# Altium schematic sheet Power.SchDoc
size B; SheetNumber: 6; SheetTotal: 6
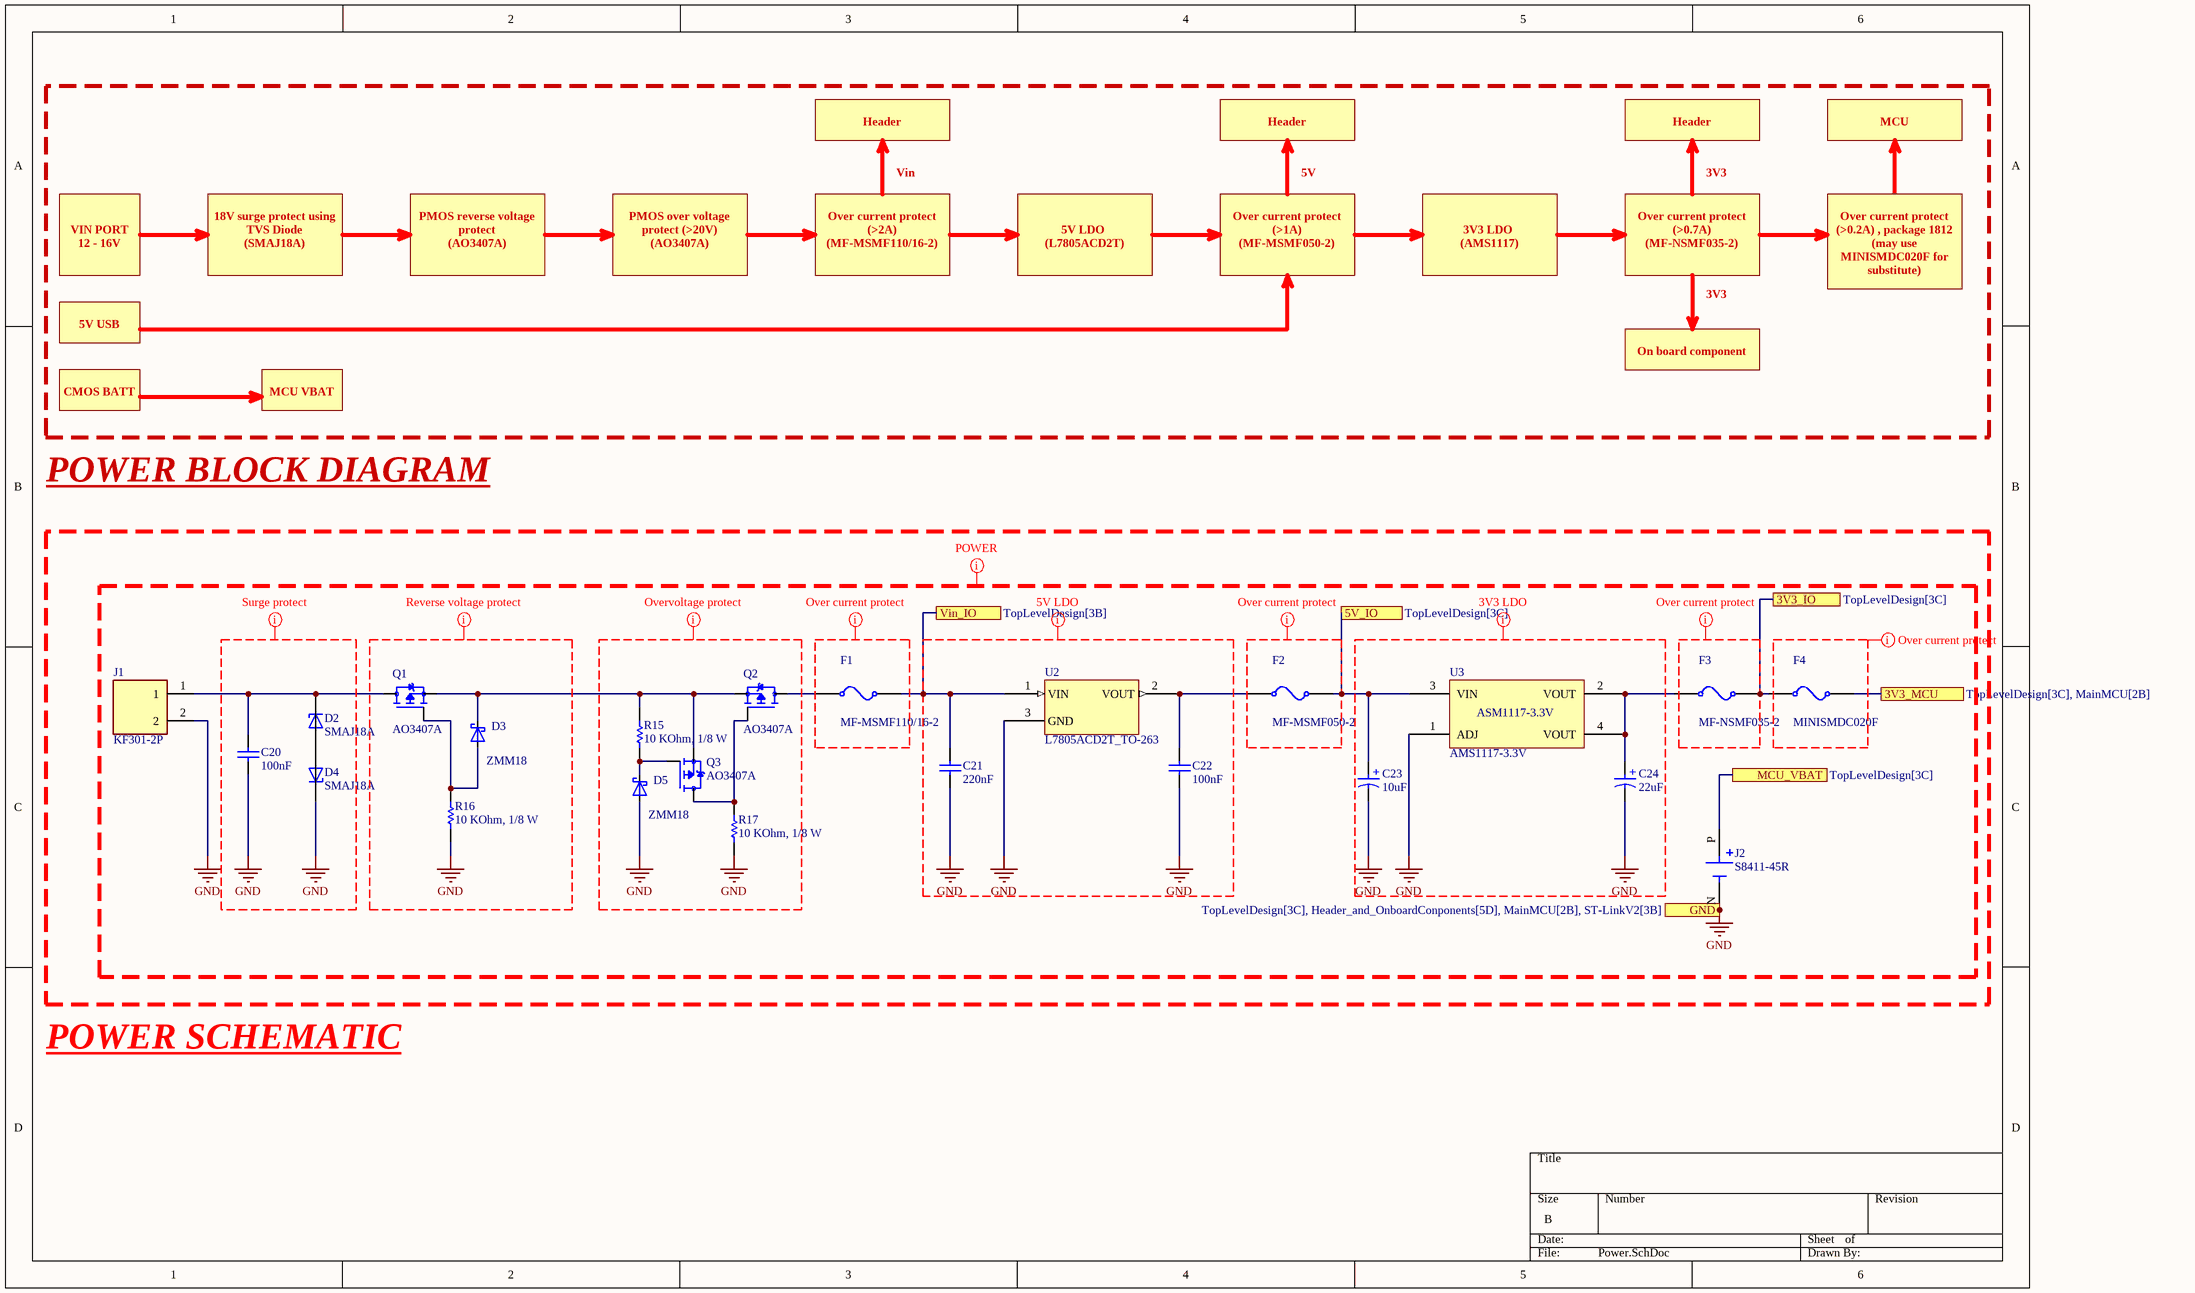
[diagram p0: Power.SchDoc]

## Parts
C20  value 100nF  [CAP_0805]  (hidden comment: 0108051041050)
C21  value 220nF  [CAP_0603]  (hidden comment: 0106032241050)
C22  value 100nF  [CAP_0603]  (hidden comment: 0106031041050)
C23  10uF  [WCAP-ASLI_D4H5.5]
C24  22uF  [WCAP-ASLI_D6.3H7.7]
D2  SMAJ18A  [DIOM4325X250N]
D3  ZMM18  [SOD-80_MiniMELF_Glass]
D4  SMAJ18A  [DIOM4325X250N]
D5  ZMM18  [SOD-80_MiniMELF_Glass]
F1  MF-MSMF110/16-2  [Fuse_SMD_1812]
F2  MF-MSMF050-2  [Fuse_SMD_1812]
F3  MF-NSMF035-2  [Fuse_SMD_1206]
F4  MINISMDC020F  [Fuse_SMD_1812]
J1  KF301-2P  [HANDSON_KF301-2P]
J2  S8411-45R  [HARWIN_S8411-45R]
Q1  AO3407A  [SOT95P280X125-3N]
Q2  AO3407A  [SOT95P280X125-3N]
Q3  AO3407A  [SOT95P280X125-3N]
R15  value 10 KOhm, 1/8 W  [RESISTOR_0805]  (hidden comment: 0008051031)
R16  value 10 KOhm, 1/8 W  [RESISTOR_0805]  (hidden comment: 0008051031)
R17  value 10 KOhm, 1/8 W  [RESISTOR_0805]  (hidden comment: 0008051031)
U2  L7805ACD2T_TO-263  [TO-263]
U3  AMS1117-3.3V  [AMS1117-3.3V SOT223]

## Ports
3V3_IO (see TopLevelDesign[3C]), 3V3_MCU (see TopLevelDesign[3C], MainMCU[2B]), 5V_IO (see TopLevelDesign[3C]), GND (see TopLevelDesign[3C], Header_and_OnboardConponents[5D], MainMCU[2B], ST-LinkV2[3B]), MCU_VBAT (see TopLevelDesign[3C]), Vin_IO (see TopLevelDesign[3B])

## Nets
GND: C20.1 C21.1 C22.1 C23.2(N) C24.2(N) D4.C D5.A J1.2 J2.N(NEG) R16.1 R17.1 U2.3(GND) U3.1(ADJ) ; port GND
3V3_IO: F3.1 F4.0 ; port 3V3_IO
3V3_MCU: F4.1 ; port 3V3_MCU
5V_IO: C23.1(P) F2.1 U3.3(VIN) ; port 5V_IO
MCU_VBAT: J2.P(POS) ; port MCU_VBAT
Vin_IO: C21.2 F1.1 U2.1(VIN) ; port Vin_IO
NetC20_2: C20.2 D2.C J1.1 Q1.3(D)
NetC22_2: C22.2 F2.0 U2.2(VOUT)
NetC24_1: C24.1(P) F3.0 U3.2(VOUT) U3.4(VOUT)
NetD2_A: D2.A D4.A
NetD3_A: D3.A Q1.1(G) R16.2
NetD3_K: D3.K Q1.2(S) Q2.2(S) Q3.2(S) R15.2
NetD5_K: D5.K Q3.1(G) R15.1
NetF1_0: F1.0 Q2.3(D)
NetQ2_1: Q2.1(G) Q3.3(D) R17.2

## Layout directives
net class POWER: GND
rule Width Constraint [Pref Width = 35mil    Min Width = 30mil    Max Width = 500mil]: GND
rule Width Constraint [Pref Width = 35mil    Min Width = 30mil    Max Width = 200mil]: (no net found under the mark), GND
rule Width Constraint [Pref Width = 20mil    Min Width = 20mil    Max Width = 200mil]: (no net found under the mark)
rule Width Constraint [Pref Width = 15mil    Min Width = 10mil    Max Width = 100mil]: (no net found under the mark)
rule Width Constraint [Pref Width = 10mil    Min Width = 10mil    Max Width = 100mil]: (no net found under the mark)
rule Width Constraint [Pref Width = 30mil    Min Width = 20mil    Max Width = 200mil]: GND
rule Width Constraint [Pref Width = 15mil    Min Width = 15mil    Max Width = 100mil]: GND

## Notes on the sheet
- Header
- MCU
- Vin
- 5V
- 3V3
- VIN PORT
  12 - 16V
- 18V surge protect using TVS Diode
  (SMAJ18A)
- PMOS reverse voltage protect
  (AO3407A)
- PMOS over voltage protect (>20V)
  (AO3407A)
- Over current protect (>2A)
  (MF-MSMF110/16-2)
- 5V LDO
  (L7805ACD2T)
- Over current protect (>1A)
  (MF-MSMF050-2)
- 3V3 LDO
  (AMS1117)
- Over current protect (>0.7A)
  (MF-NSMF035-2)
- Over current protect (>0.2A) , package 1812
  (may use MINISMDC020F for substitute)
- 5V USB
- On board component
- CMOS BATT
- MCU VBAT
- POWER BLOCK DIAGRAM
- POWER SCHEMATIC
- (in symbol CMP-014-00039-1) +
- (in symbol CMP-014-00073-1) +
- (in symbol CMP-098-000004-1) ASM1117-3.3V

## Library data of the parts
C20 = CMP-001-00259-1: CAP, size 0805, 0.1 nF, 50 VDC; Manufacture Name: TDK; Manufacture SN: CGA4J2X8R1H104K125AD; Voltage Rating DC: 50 VDC; Tolerance: 10%; Pins: 2; Supplier 2 URL: https://www.digikey.com/en/products/detail/tdk-corporation/cga4j2x8r1h104k125ad/3248169; Supplier 1 SN: 810-C2012X8R1H104KEP; Supplier 1 Name: Mouser; Supplier 3 Name: thegioiic; Mounting Technology: SMT; Source: Capacitor_0805_10_percent.SchLib; Supplier 2 SN: 445-8810-2-ND; Supplier 3 SN: OEM; Operating Temperature: -55 to +125degC; Supplier 2 Name: Digi-Key; Component Type: Standard; Design Item ID: 0108051041050; Supplier 1 URL: https://www.mouser.vn/ProductDetail/TDK/CGA4J2X8R1H104K125AD?qs=LcTL%2F5vFEzExqZqv3rh1qQ%3D%3D&utm_source=mouser-refine-download&utm_medium=file&utm_campaign=CGA4J2X8R1H104K125AD&utm_content=TDK; Supplier 3 URL: N/A; Packaging: Tape and Reel; Size: 0805
C21 = CMP-001-00231-1: CAP, size 0603, 220 nF, 50 VDC; Manufacture Name: TDK; Manufacture SN: CGA3E3X7R1H224K080AE; Tolerance: 10%; Voltage Rating DC: 50 VDC; Supplier 2 SN: 445-173635-2-ND; Supplier 3 SN: N/A; Supplier 2 URL: https://www.digikey.com/en/products/detail/tdk-corporation/cga3e3x7r1h224k080ae/5809200; Supplier 3 Name: thegioiic; Supplier 3 URL: N/A; Component Type: Standard; Supplier 2 Name: Digi-Key; Supplier 1 Name: Mouser; Size: 0603; Design Item ID: 0106032241050; Supplier 1 SN: 810-CGA3E3X7R1H224KA; Source: Capacitor_0603_10_percent.SchLib; Pins: 2; Supplier 1 URL: https://www.mouser.com/ProductDetail/TDK/CGA3E3X7R1H224K080AE?qs=nQSIdc08i%252Bd73MzLq310Yg%3D%3D&utm_source=mouser-refine-download&utm_medium=file&utm_campaign=CGA3E3X7R1H224K080AE&utm_content=TDK; Mounting Technology: SMT; Operating Temperature: -55 to +125degC; Packaging: Tape and Reel
C22 = CMP-001-00214-1: CAP, size 0603, 100 nF, 50 VDC; Manufacture SN: CGA3E3X8R1H104K080AE; Manufacture Name: TDK; Tolerance: 10%; Voltage Rating DC: 50 VDC; Supplier 2 Name: Digi-Key; Pins: 2; Supplier 3 Name: thegioiic; Design Item ID: 0106031041050; Supplier 1 Name: Mouser; Supplier 1 URL: https://www.mouser.com/ProductDetail/TDK/CGA3E3X8R1H104K080AE?qs=nQSIdc08i%252Bd8g3IRRgU2bw%3D%3D&utm_source=mouser-refine-download&utm_medium=file&utm_campaign=CGA3E3X8R1H104K080AE&utm_content=TDK; Size: 0603; Supplier 2 URL: https://www.digikey.com/en/products/detail/tdk-corporation/cga3e3x8r1h104k080ae/5809262; Operating Temperature: -55 to +125degC; Packaging: Tape and Reel; Source: Capacitor_0603_10_percent.SchLib; Supplier 1 SN: 810-CGA3E3X8R1H104KA; Supplier 3 SN: N/A; Supplier 2 SN: 445-173697-2-ND; Mounting Technology: SMT; Supplier 3 URL: N/A; Component Type: Standard
C23 = CMP-014-00039-1: V-Chip, D4 x H5.5mm, 10uF, 16V; Manufacturer: Wurth Elektronik; Endurance: 2000h; Dissipation Factor: 16%; Capacitance: 10µF; Ripple Current: 80mA; Capacitance Tolerance: +/-20%; Leakage Current: 3uA; Supplier 2 URL: N/A; Supplier 1 URL: https://www.mouser.com/ProductDetail/Wurth-Elektronik/865080340001?qs=0KOYDY2FL2%252BaqRFD837lAw%3D%3D; Manufacturer Part Number: N/A; Value: 10uF, 16V; Supplier 3 Name: thegioiic; Operating Temperature Min: -55°C; Height: 5.5mm; Category: Aluminum Electrolytic Capacitors; Diameter: 4mm; Packaging: Tape and Reel; Component Type: Standard; Supplier 3 URL: https://www.thegioiic.com/tu-nhom-smd-10uf-16v-4x5-4mm; Design Item ID: 865080340001; Supplier 1 SN: 710-865080340001; Pins: 2; Supplier 2 Name: Digi-Key; Supplier 1 Name: Mouser; Mount: Surface Mount; Supplier 3 SN: N/A; Operating Temperature Max: 105°C; Supplier 2 SN: N/A; Rated Voltage (DC): 16V; Source: Al_Cap.SchLib
C24 = CMP-014-00073-1: V-Chip, D6.3 x H7.7mm, 22uF, 63V; Manufacturer: Wurth Elektronik; Leakage Current: 13.86uA; Endurance: 2000h; Capacitance: 22µF; Ripple Current: 58mA; Capacitance Tolerance: +/-20%; Dissipation Factor: 12%; Supplier 2 URL: N/A; Supplier 2 Name: Digi-Key; Supplier 2 SN: N/A; Category: Aluminum Electrolytic Capacitors; Value: 22uF, 63V; Operating Temperature Min: -55°C; Design Item ID: 865080745011; Supplier 1 SN: 710-865080745011; Packaging: Tape and Reel; Supplier 3 Name: thegioiic; Supplier 1 URL: https://www.mouser.vn/ProductDetail/Wurth-Elektronik/865080745011?qs=amGC7iS6iy%2FPRPUkpVJ4xg%3D%3D; Source: Al_Cap.SchLib; Component Type: Standard; Operating Temperature Max: 105°C; Rated Voltage (DC): 63V; Supplier 3 URL: https://www.thegioiic.com/tu-nhom-smd-22uf-63v-6-3x7-7mm; Height: 7.7mm; Diameter: 6.3mm; Supplier 1 Name: Mouser; Pins: 2; Supplier 3 SN: N/A; Mount: Surface Mount; Manufacturer Part Number: N/A
D2 D4 = CMP-004-00085-1: 400W, 21.1V, 5%, Unidirectional, TVS; MF: Taiwan Semiconductor; SnapEDA_Link: https://www.snapeda.com/parts/SMAJ18A/taiwan/view-part/?ref=snap; Value: *; Component Type: Standard; Case/Package: SMA-2 Taiwan Semiconductor; Check_prices: https://www.snapeda.com/parts/SMAJ18A/taiwan/view-part/?ref=eda; Source: SMAJ18A.SchLib; Design Item ID: SMAJ18A; Pins: 2; MP: SMAJ18A
D3 D5 = CMP-004-00086-2: Value: Shottky-Diode; Reference: D; ki_keywords: Schottky; ki_description: Schottky Diode; Component Type: Standard; Pins: 2; Source: schottky-diode.SchLib; Design Item ID: Schottky-Diode; Datasheet: https://diotec.com/de/produktliste/SBD.html
F1 = CMP-005-00054-1: Resettable Fuse, Size 1812, 16V, 1.1A; Manufacturer: Bourns; Trip Current: 2.2A; Threshold Current: 100A; Threshold Voltage: 16V; Supplier 1 URL: https://www.mouser.vn/ProductDetail/Bourns/MF-MSMF110-16-2?qs=wksszfECgvir54ST3ixUHA%3D%3D; Supplier 3 URL: https://www.thegioiic.com/mf-msmf110-16-2-cau-chi-tu-phuc-hoi-1812-16v-1-1a; ComponentLink2URL: https://www.mouser.vn/ProductDetail/Bourns/MF-MSMF110-16-2?qs=wksszfECgvir54ST3ixUHA%3D%3D; Size: 1812; Supplier 2 SN: MF-MSMF110/16-2TR-ND; Supplier 2 URL: https://www.mouser.vn/ProductDetail/Bourns/MF-MSMF110-16-2?qs=wksszfECgvir54ST3ixUHA%3D%3D; Supplier 1 SN: 652-MF-MSMF110/16-2; Supplier 3 SN: MF-MSMF110/16-2; ComponentLink3URL: https://www.digikey.com/en/products/detail/bourns-inc/MF-MSMF110-16-2/662820; Design Item ID: 061812110016; Pins: 2; Value: 16V, 1.1A; ComponentLink4Description: Supplier 3 URL; ComponentLink3Description: Supplier 2 URL; ComponentLink2Description: Supplier 1 URL; Supplier 1 Name: Mouser; Component Type: Standard; ComponentLink1URL: https://www.bourns.com/docs/Product-Datasheets/mfnsmf.pdf; Supplier 3 Name: thegioiic; ComponentLink4URL: https://www.thegioiic.com/mf-msmf110-16-2-cau-chi-tu-phuc-hoi-1812-16v-1-1a; Supplier 2 Name: Digi-Key; ComponentLink1Description: Datasheet link; Mounting Technology: SMT/SMD; Source: Fuse_SMD.SchLib; Hold Current: 1.1A
F2 = CMP-005-00051-1: Resettable Fuse, Size 1812, 15V, 0.5A; Manufacturer: Bourns; Threshold Current: 100A; Trip Current: 1A; Supplier 2 URL: https://www.mouser.vn/ProductDetail/Bourns/MF-MSMF050-2?qs=t3shhpq1i1DZ7OBD5kLNoA%3D%3D; ComponentLink3Description: Supplier 2 URL; Size: 1812; Supplier 3 URL: https://www.thegioiic.com/mf-msmf050-2-cau-chi-tu-phuc-hoi-1812-15v-0-5a; Design Item ID: 061812050015; ComponentLink2Description: Supplier 1 URL; Mounting Technology: SMT/SMD; Supplier 1 Name: Mouser; ComponentLink1URL: https://www.bourns.com/docs/Product-Datasheets/mfnsmf.pdf; Supplier 2 Name: Digi-Key; ComponentLink1Description: Datasheet link; ComponentLink2URL: https://www.mouser.vn/ProductDetail/Bourns/MF-MSMF050-2?qs=t3shhpq1i1DZ7OBD5kLNoA%3D%3D; Supplier 1 URL: https://www.mouser.vn/ProductDetail/Bourns/MF-MSMF050-2?qs=t3shhpq1i1DZ7OBD5kLNoA%3D%3D; Source: Fuse_SMD.SchLib; Value: 15V, 0.5A; Component Type: Standard; Supplier 3 Name: thegioiic; ComponentLink4URL: https://www.thegioiic.com/mf-msmf050-2-cau-chi-tu-phuc-hoi-1812-15v-0-5a; Supplier 2 SN: MF-MSMF050-2TR-ND; Supplier 3 SN: MF-MSMF050-2; Hold Current: 0.5A; Threshold Voltage: 15V; Pins: 2; ComponentLink3URL: https://www.digikey.com/en/products/detail/bourns-inc/MF-MSMF050-2/662816?s=N4IgTCBcDaILIDEC0cDKiAMBWDSIF0BfIA; ComponentLink4Description: Supplier 3 URL; Supplier 1 SN: 652-MF-MSMF050-2
F3 = CMP-005-00048-1: Resettable Fuse, Size 1206, 6V, 0.35A; Manufacturer: Bourns; Trip Current: 0.75A; Threshold Current: 100A; Supplier 3 URL: https://www.thegioiic.com/mf-nsmf035-2-cau-chi-tu-phuc-hoi-1206-6v-0-35a; ComponentLink1Description: Datasheet link; Supplier 1 URL: https://www.mouser.vn/ProductDetail/Bourns/MF-NSMF035-2?qs=3eVyCPG4fwnHDrvs%2FGppSw%3D%3D; ComponentLink3URL: https://www.digikey.com/en/products/detail/bourns-inc/MF-NSMF035-2/1232784?s=N4IgTCBcDaILIDEC0A5AyogDAZgKxIgF0BfIA; Threshold Voltage: 6V; ComponentLink3Description: Supplier 2 URL; Supplier 1 Name: Mouser; Value: 6V, 0.35A; Supplier 2 URL: https://www.mouser.vn/ProductDetail/Bourns/MF-NSMF035-2?qs=3eVyCPG4fwnHDrvs%2FGppSw%3D%3D; Component Type: Standard; Supplier 2 Name: Digi-Key; Supplier 1 SN: 652-MF-NSMF035-2; ComponentLink2URL: https://www.mouser.vn/ProductDetail/Bourns/MF-NSMF035-2?qs=3eVyCPG4fwnHDrvs%2FGppSw%3D%3D; Source: Fuse_SMD.SchLib; Pins: 2; Supplier 3 Name: thegioiic; Supplier 2 SN: MF-NSMF035-2TR-ND; ComponentLink2Description: Supplier 1 URL; Mounting Technology: SMT/SMD; ComponentLink4Description: Supplier 3 URL; Size: 1206; Design Item ID: 061206035006; ComponentLink1URL: https://www.bourns.com/docs/Product-Datasheets/mfnsmf.pdf; Hold Current: 0.35A; Supplier 3 SN: MF-NSMF035-2; ComponentLink4URL: https://www.thegioiic.com/mf-nsmf035-2-cau-chi-tu-phuc-hoi-1206-6v-0-35a
F4 = CMP-005-00050-1: Resettable Fuse, Size 1812, 30V, 0.2A; Manufacturer: Bourns; Threshold Current: 80A; Trip Current: 0.4A; ComponentLink4Description: Supplier 3 URL; ComponentLink2URL: https://www.mouser.vn/ProductDetail/Bourns/MF-MSMF020-2?qs=YYkh393lUtjbPn24kFIUNQ%3D%3D; Value: 30V, 0.2A; Supplier 3 URL: https://www.thegioiic.com/mf-msmf020-2-cau-chi-tu-phuc-hoi-1812-0-20a-30v; Supplier 1 URL: https://www.mouser.vn/ProductDetail/Bourns/MF-MSMF020-2?qs=YYkh393lUtjbPn24kFIUNQ%3D%3D; Component Type: Standard; Supplier 2 SN: MF-MSMF020-2TR-ND; ComponentLink1URL: https://www.bourns.com/docs/Product-Datasheets/mfnsmf.pdf; Pins: 2; Hold Current: 0.2A; ComponentLink1Description: Datasheet link; Supplier 1 SN: 652-MF-MSMF020-2; ComponentLink2Description: Supplier 1 URL; Supplier 2 URL: https://www.mouser.vn/ProductDetail/Bourns/MF-MSMF020-2?qs=YYkh393lUtjbPn24kFIUNQ%3D%3D; Supplier 1 Name: Mouser; ComponentLink3URL: https://www.digikey.com/en/products/detail/bourns-inc/MF-MSMF020-2/662814?s=N4IgTCBcDaILIDEC0cDKiAMYNLAAhAF0BfIA; Mounting Technology: SMT/SMD; Threshold Voltage: 30V; ComponentLink4URL: https://www.thegioiic.com/mf-msmf020-2-cau-chi-tu-phuc-hoi-1812-0-20a-30v; Supplier 2 Name: Digi-Key; Supplier 3 Name: thegioiic; Design Item ID: 061812020030; ComponentLink3Description: Supplier 2 URL; Size: 1812; Source: Fuse_SMD.SchLib; Supplier 3 SN: MF-MSMF020-2
J1 = CMP-118-000001-1: 2 Pin Terminal Block 5mm Pitch; MP: KF301-2P; Design Item ID: KF301-2P; Value: *; Price: None; Package: None; Availability: Unavailable; Source: KF301-2P.SchLib
J2 = CMP-00029-00003-1: Coin Cell Battery Retainer, Horizontal SMT, for CR1220 Coin Cell Batteries, Tape & Reeled; MF: Harwin; Case/Package: None; Check_prices: https://www.snapeda.com/parts/S8411-45R/Harwin+Inc./view-part/?ref=eda; Source: S8411-45R.SchLib; SnapEDA_Link: https://www.snapeda.com/parts/S8411-45R/Harwin+Inc./view-part/?ref=snap; Value: *; Component Type: Standard; Pins: 2; Design Item ID: S8411-45R; MP: S8411-45R
Q1-Q3 = CMP-123-000000-1: P-Channel 30 V 4.3A (Ta) 1.4W (Ta) Surface Mount SOT-23-3; MF: Alpha &; Design Item ID: AO3407A; Check_prices: https://www.snapeda.com/parts/AO3407A/Alpha/view-part/?ref=eda; SnapEDA_Link: https://www.snapeda.com/parts/AO3407A/Alpha/view-part/?ref=snap; Source: AO3407A.SchLib; Pin Count: 3; Package: SOT-23 Alpha &amp; Omega Semiconductor; Value: *; Component Type: Standard; MP: AO3407A
R15-R17 = CMP-009-00482-1: RES, size 0805, 10 KOhm, 1/8 W; Manufacture  Name: Vishay Dale; Manufacture  SN: CRCW080515K0FKEAC; Rated Power: 1/8 W; Resistance Tolerance: +/-1%; ComponentLink3URL: https://www.digikey.com/en/products/detail/vishay-dale/CRCW080515K0FKEAC/7928558; Supplier 3 SN: N/A; ComponentLink1URL: https://www.vishay.com/docs/28773/crcwce3.pdf; ComponentLink2Description: Supplier 1 URL; Mounting Technology: SMT; Supplier 1 SN: 71-CRCW0805-15K-E3; ComponentLink3Description: Supplier 2 URL; Pins: 2; Size: 0805; ComponentLink1Description: Datasheet link; Supplier 3 URL: N/A; Source: Resistor_0805.SchLib; Supplier 2 URL: https://www.digikey.com/en/products/detail/vishay-dale/CRCW080515K0FKEAC/7928558; ComponentLink4URL: N/A; Supplier 1 URL: https://www.mouser.vn/ProductDetail/Vishay-Dale/CRCW080515K0FKEA?qs=bMjB6bAaLEM4rXT2DoR3BA%3D%3D; Supplier 1 Name: Mouser; Design Item ID: 0008051531; Supplier 2 SN: 541-4136-2-ND; Component Type: Standard; ComponentLink2URL: https://www.mouser.vn/ProductDetail/Vishay-Dale/CRCW080515K0FKEA?qs=bMjB6bAaLEM4rXT2DoR3BA%3D%3D; Supplier 2 Name: Digi-Key; ComponentLink4Description: Supplier 3 URL; Supplier 3 Name: Thegioiic
U2 = CMP-098-000007-1: Out: 5V, 1.5A; In: 7V to 35V; Pacakge: TO-263; Supplier 2 URL: https://www.digikey.com/en/products/detail/stmicroelectronics/L7805ACD2T-TR/1038230; Supplier 2 SN: 497-7253-2-ND; Package: TO-263; Component Type: Standard; Voltage Input Maximum: 7V to 35V; Output Current: 1.5A; Design Item ID: L7805ACD2T_TO-263; Supplier 3 SN: N/A; ComponentLink4Description: Supplier 3 URL; ComponentLink4URL: https://www.thegioiic.com/l7805acd2t-ic-on-ap-5v-1-5a; Supplier 1 URL: https://www.mouser.com/ProductDetail/STMicroelectronics/L7805ACD2T-TR?qs=Ctxo64yJVFuOLXlPPZdJUQ%3D%3D; Supplier 3 URL: https://www.thegioiic.com/l7805acd2t-ic-on-ap-5v-1-5a; Value: 5V, 1.5A; Pin Count: 3; Supplier 2 Name: Digi-Key; ComponentLink1Description: Datasheet link; Voltage Output: 5V; ComponentLink3Description: Supplier 2 URL; Supplier 1 SN: 511-L7805ACD2T-TR; ComponentLink3URL: https://www.digikey.com/en/products/detail/stmicroelectronics/L7805ACD2T-TR/1038230; Supplier 3 Name: thegioiic; ComponentLink2URL: https://www.mouser.com/ProductDetail/STMicroelectronics/L7805ACD2T-TR?qs=Ctxo64yJVFuOLXlPPZdJUQ%3D%3D; Source: 78xx.SchLib; ComponentLink2Description: Supplier 1 URL; Supplier 1 Name: Mouser; ComponentLink1URL: https://www.st.com/resource/en/datasheet/l78.pdf
U3 = CMP-098-000004-1: AMS1117-3.3V, OUT 3.3V 1A.; Manufacturer: AMS; Pad Count: 4; Voltage Input Maximum: 15V; Current Output Maximum: 1A; Value: 3.3V, 1A; ComponentLink1Description: Datasheet link; Component Type: Standard; Current Input Maximum: N/A; Mounting Technology: SMD; Supplier 3 Name: thegioiic; ComponentLink4Description: Supplier 3 URL; ComponentLink2URL: N/A; Voltage Output: 3.3V; Supplier 2 SN: N/A; Supplier 3 SN: N/A; Supplier 1 URL: N/A; Supplier 2 URL: N/A; Source: AMS_family.SchLib; ComponentLink1URL: http://www.advanced-monolithic.com/pdf/ds1117.pdf; Supplier 3 URL: https://www.thegioiic.com/ams1117-3-3v-ic-on-ap-3-3v-1a-sot-223; ComponentLink4URL: N/A; Supplier 1 Name: Mouser; Supplier 1 SN: N/A; Supplier 2 Name: Digi-Key; ComponentLink2Description: Supplier 1 URL; Manufacturer Part Number: N/A; ComponentLink3URL: N/A; Design Item ID: AMS1117-3.3V; ComponentLink3Description: Supplier 2 URL; Pin Count: 4